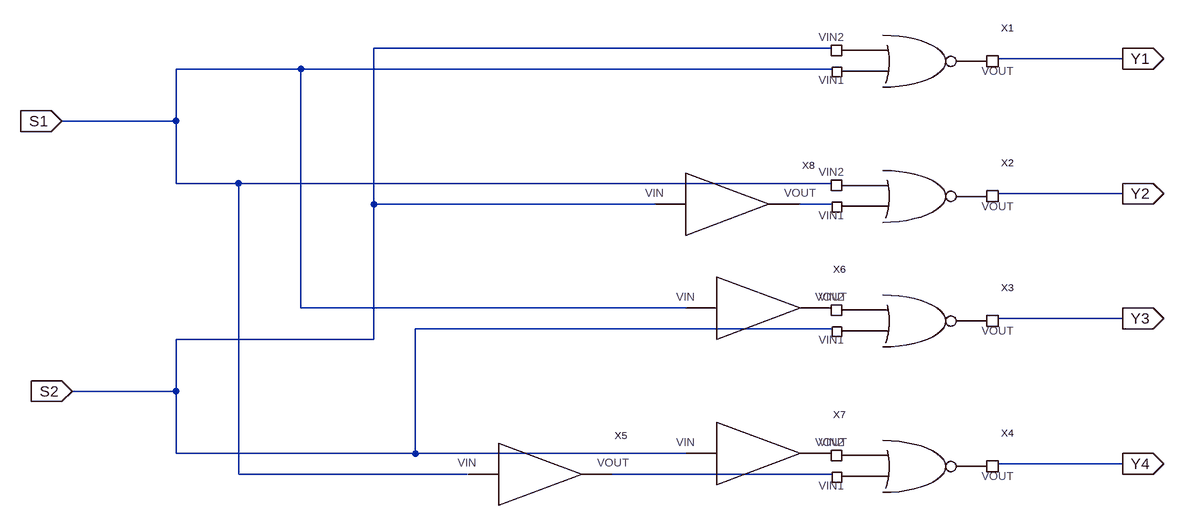
[diagram p0: schematic decoder.asc]
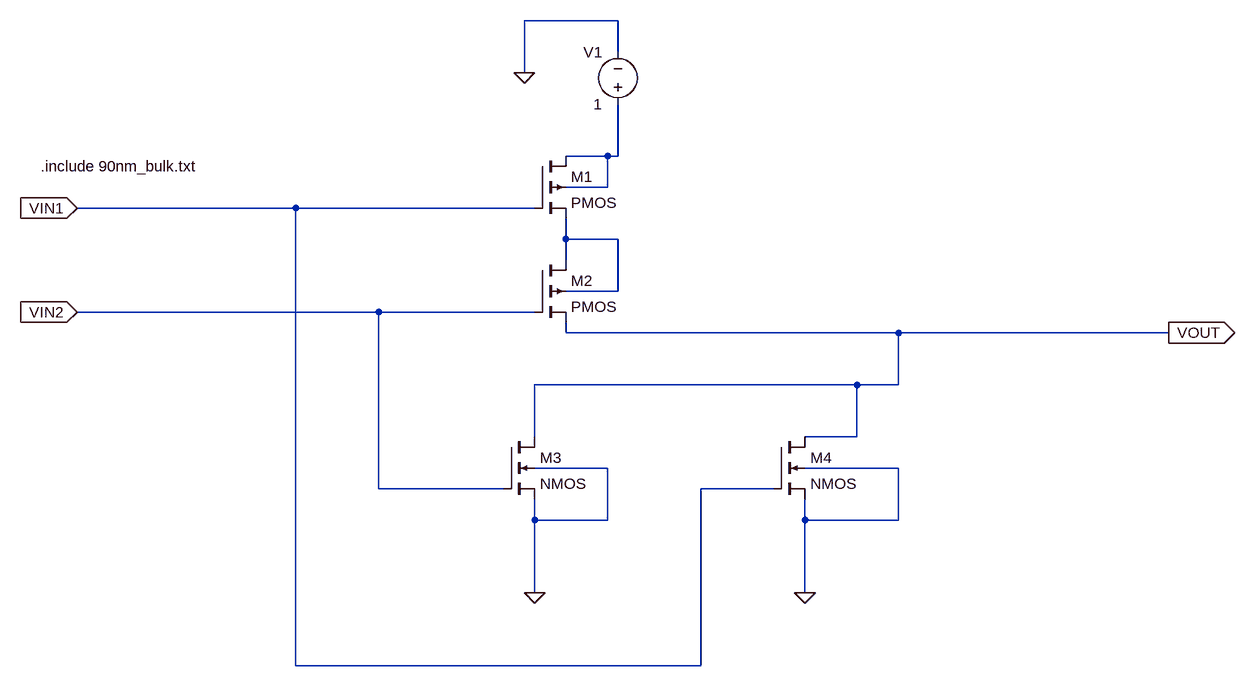
[diagram p1: sub-circuit symbol_valve.asc]
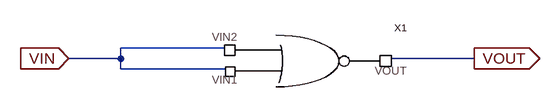
[diagram p2: sub-circuit not.asc]
decoder.asc, the LTspice schematic file:
Version 4
SHEET 1 2184 680
WIRE 1648 -448 944 -448
WIRE 2096 -432 1904 -432
WIRE 832 -416 640 -416
WIRE 1648 -416 832 -416
WIRE 640 -336 640 -416
WIRE 640 -336 464 -336
WIRE 640 -240 640 -336
WIRE 736 -240 640 -240
WIRE 1648 -240 736 -240
WIRE 2096 -224 1904 -224
WIRE 944 -208 944 -448
WIRE 1376 -208 944 -208
WIRE 1648 -208 1600 -208
WIRE 832 -48 832 -416
WIRE 1424 -48 832 -48
WIRE 2096 -32 1904 -32
WIRE 1648 -16 1008 -16
WIRE 944 0 944 -208
WIRE 944 0 640 0
WIRE 640 80 640 0
WIRE 640 80 480 80
WIRE 640 176 640 80
WIRE 1008 176 1008 -16
WIRE 1008 176 640 176
WIRE 1424 176 1008 176
WIRE 2096 192 1904 192
WIRE 736 208 736 -240
WIRE 1088 208 736 208
WIRE 1648 208 1312 208
FLAG 464 -336 S1
IOPIN 464 -336 In
FLAG 480 80 S2
IOPIN 480 80 In
FLAG 2096 -432 Y1
IOPIN 2096 -432 Out
FLAG 2096 -224 Y2
IOPIN 2096 -224 Out
FLAG 2096 -32 Y3
IOPIN 2096 -32 Out
FLAG 2096 192 Y4
IOPIN 2096 192 Out
SYMBOL symbol_valve 1776 -368 R0
SYMATTR InstName X1
SYMBOL symbol_valve 1776 -160 R0
SYMATTR InstName X2
SYMBOL symbol_valve 1776 32 R0
SYMATTR InstName X3
SYMBOL symbol_valve 1776 256 R0
SYMATTR InstName X4
SYMBOL not 1168 208 R0
SYMATTR InstName X5
SYMBOL not 1504 -48 R0
SYMATTR InstName X6
SYMBOL not 1504 176 R0
SYMATTR InstName X7
SYMBOL not 1456 -208 R0
WINDOW 39 0 0 Left 0
SYMATTR InstName X8

symbol_valve.asc, the sub-circuit schematic file:
Version 4
SHEET 1 1116 900
WIRE 144 -96 0 -96
WIRE 144 -48 144 -96
WIRE 0 -16 0 -96
WIRE 128 112 64 112
WIRE 144 112 144 32
WIRE 144 112 128 112
WIRE 128 160 128 112
WIRE 128 160 64 160
WIRE -352 192 -688 192
WIRE 16 192 -352 192
WIRE 64 240 64 208
WIRE 144 240 64 240
WIRE 64 272 64 240
WIRE 144 320 144 240
WIRE 144 320 64 320
WIRE -224 352 -688 352
WIRE 16 352 -224 352
WIRE 64 384 64 368
WIRE 576 384 64 384
WIRE 992 384 576 384
WIRE 512 464 16 464
WIRE 576 464 576 384
WIRE 576 464 512 464
WIRE 16 544 16 464
WIRE 512 544 512 464
WIRE 512 544 432 544
WIRE 128 592 16 592
WIRE 576 592 432 592
WIRE -224 624 -224 352
WIRE -32 624 -224 624
WIRE 384 624 272 624
WIRE 16 672 16 640
WIRE 128 672 128 592
WIRE 128 672 16 672
WIRE 432 672 432 640
WIRE 576 672 576 592
WIRE 576 672 432 672
WIRE 16 784 16 672
WIRE 432 784 432 672
WIRE -352 896 -352 192
WIRE 272 896 272 624
WIRE 272 896 -352 896
FLAG 16 784 0
FLAG 432 784 0
FLAG 992 384 VOUT
IOPIN 992 384 Out
FLAG -688 192 VIN1
IOPIN -688 192 In
FLAG -688 352 VIN2
IOPIN -688 352 In
FLAG 0 -16 0
SYMBOL pmos4 16 112 R0
SYMATTR InstName M1
SYMATTR Value2 l=90n w=400n
SYMBOL pmos4 16 272 R0
SYMATTR InstName M2
SYMATTR Value2 l=90n w=400n
SYMBOL nmos4 -32 544 R0
SYMATTR InstName M3
SYMATTR Value2 l=90n w=200n
SYMBOL nmos4 384 544 R0
SYMATTR InstName M4
SYMATTR Value2 l=90n w=200n
SYMBOL voltage 144 48 R180
WINDOW 0 24 96 Left 2
WINDOW 3 24 16 Left 2
WINDOW 123 0 0 Left 0
WINDOW 39 0 0 Left 0
SYMATTR InstName V1
SYMATTR Value 1
TEXT -744 128 Left 2 !.include 90nm_bulk.txt

not.asc, the sub-circuit schematic file:
Version 4
SHEET 1 880 680
WIRE 128 160 -32 160
WIRE -32 176 -32 160
WIRE -32 176 -112 176
WIRE 512 176 384 176
WIRE -32 192 -32 176
WIRE 128 192 -32 192
FLAG -112 176 VIN
IOPIN -112 176 In
FLAG 512 176 VOUT
IOPIN 512 176 Out
SYMBOL symbol_valve 256 240 R0
SYMATTR InstName X1

The netlist it stands for:
* decoder.asc
XX1 S1 S2 Y1 symbol_valve
XX2 N001 S1 Y2 symbol_valve
XX3 S2 P001 Y3 symbol_valve
XX4 N002 P002 Y4 symbol_valve
XX5 S1 N002 not
XX6 S1 P001 not
XX7 S2 P002 not
XX8 S2 N001 not

* block symbol definitions
.subckt symbol_valve VIN1 VIN2 VOUT
M1 N001 VIN1 N002 N001 PMOS l=90n w=400n
M2 N002 VIN2 VOUT N002 PMOS l=90n w=400n
M3 VOUT VIN2 0 0 NMOS l=90n w=200n
M4 VOUT VIN1 0 0 NMOS l=90n w=200n
V1 N001 0 1
.include 90nm_bulk.txt
.ends symbol_valve

.subckt not VIN VOUT
XX1 VIN VIN VOUT symbol_valve
.ends not

.model NMOS NMOS
.model PMOS PMOS
.lib standard.mos
.backanno
.end